# EAGLE schematic schematic design (EAGLE 9.6.2)
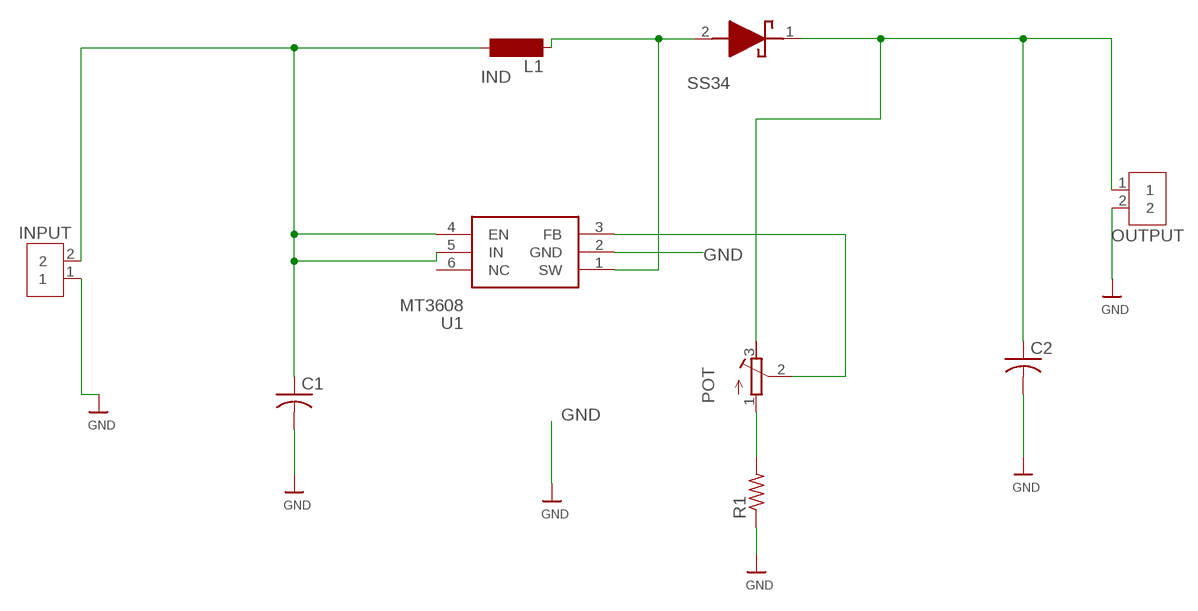
[diagram p0: schematic, sheet 1]

## Parts
C1  C-USC0805  [C0805]
C2  C-USC0805  [C0805]
D1  SS34  [DIOM7959X262N]
INPUT  2828XX-2282834-2  [TERMBLK_254-2N]
L1  MS42  [MS42]
OUTPUT  2828XX-2282834-2  [TERMBLK_254-2N]
POT  R-TRIMM3296W  [RTRIM3296W]
R1  R-US_M0805  [M0805]
U1  MT3608  [SOT95P280X145-6N]

## Nets
GND: C1.2 C2.2 INPUT.1 OUTPUT.2 R1.1 U1.2(GND)
IND: D1.2(A) L1.1 U1.1(SW)
N$1: C1.1 INPUT.2 L1.2 U1.4(EN) U1.5(IN)
N$2: POT.1(A) R1.2
N$4: POT.2(S) U1.3(FB)
N$5: C2.1 D1.1(K) OUTPUT.1 POT.3(E)
Unconnected: U1.6(NC)

## Library data of the parts
C1 C2 = adafruit:C-US: CAPACITOR, American symbol
D1 = SS34:SS34: TAIWAN SEMICONDUCTOR - SS34 - DIODE, SCHOTTKY, 3A, 40V Source: Datasheet <https://componentsearchengine.com/Datasheets/1/SS34.pdf>; DESCRIPTION: TAIWAN SEMICONDUCTOR - SS34 - DIODE, SCHOTTKY, 3A, 40V; HEIGHT: 2.62mm; MANUFACTURER_NAME: Taiwan Semiconductor; MANUFACTURER_PART_NUMBER: SS34; MOUSER_PART_NUMBER: 821-SS34; MOUSER_PRICE-STOCK: https://www.mouser.co.uk/ProductDetail/Taiwan-Semiconductor/SS34?qs=JV7lzlMm3yIimVqgKV%2F1SA%3D%3D
INPUT OUTPUT = Connector:2828XX-2: 2 Position Wire to Board Terminal Block Horizontal with Board Datasheet <https://www.te.com.cn/commerce/DocumentDelivery/DDEController?Action=showdoc&DocId=Catalog+Section%7F1308389_EUROSTYLE_TERMINAL_BLOCKS%7F0607%7Fpdf%7FEnglish%7FENG_CS_1308389_EUROSTYLE_TERMINAL_BLOCKS_0607.pdf%7F2-282837-5>
L1 = inductor-neosid:MS42: INDUCTOR SMD inductor; OC_FARNELL: unknown; OC_NEWARK: unknown
POT = resistor:R-TRIMM: Trimm resistor
R1 = adafruit:R-US_: RESISTOR, American symbol
U1 = MT3608:MT3608: High Efficiency 1.2MHz 2A Step Up Converter Source: Datasheet <https://www.olimex.com/Products/Breadboarding/BB-PWR-3608/resources/MT3608.pdf>; DESCRIPTION: High Efficiency 1.2MHz 2A Step Up Converter; HEIGHT: 1.45mm; MANUFACTURER_NAME: Aerosemi; MANUFACTURER_PART_NUMBER: MT3608

## Net classes
0 default: width 0.305 mm, drill 0.254 mm, clearance 0.254 mm